# EasyEDA schematic External MIDI Interface.json
TITLE: XMIDIMixer; REV: 1.0; Date: 2022-04-16; Sheet: 1/1; Drawn By: OctSL; Company: Your Company
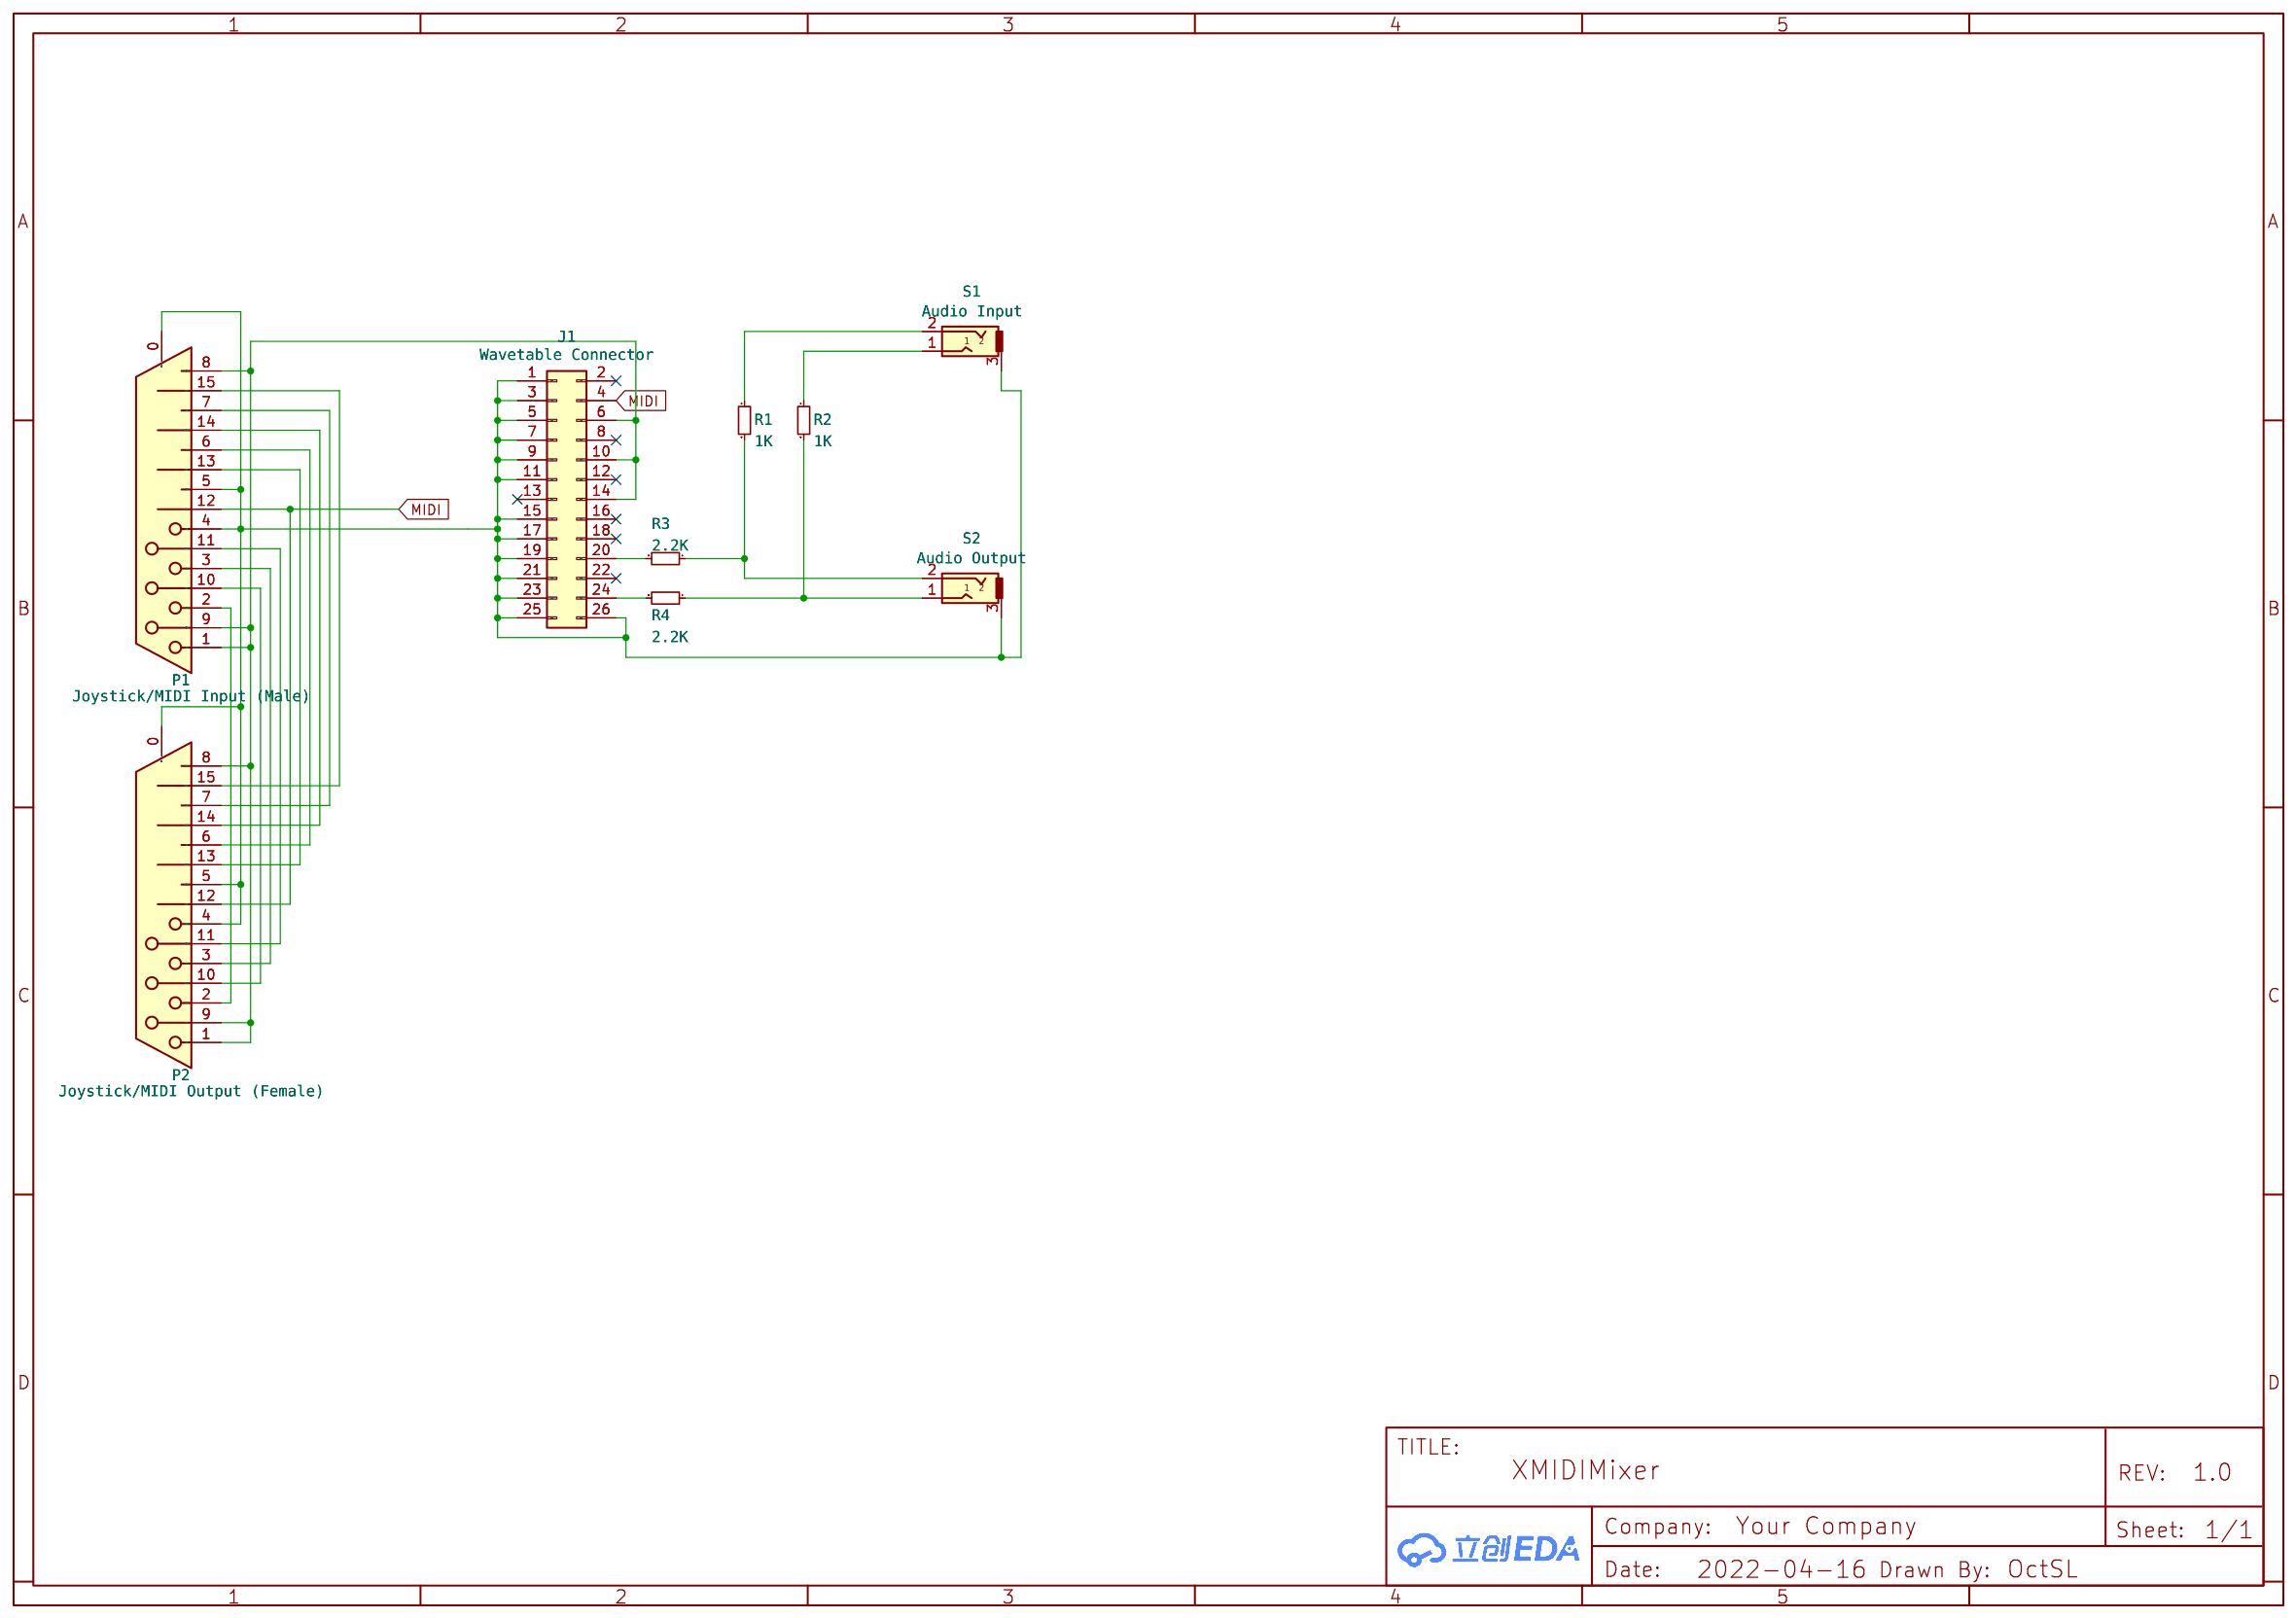
[diagram p0: schematic sheet]

## Parts
J1  Wavetable Connector  [PINSOCKET_2X13_P2.54MM_VERTICAL]
P1  Joystick/MIDI Input (Male)  [SB_DB15_152-3415]
P2  Joystick/MIDI Output (Female)  [SB_DB15_152-3415]
R1  1K  [SB_R_AXIAL_400]
R2  1K  [SB_R_AXIAL_400]
R3  2.2K  [SB_R_AXIAL_400]
R4  2.2K  [SB_R_AXIAL_400]
S1  Audio Input  [SB_SJ1-3553]
S2  Audio Output  [SB_SJ1-3553]

## Library data of the parts
P1 P2 = -: Mouser: 152-3415
R1 R2 = -: Mouser: 603-CFR-25JB-52-47K
R3 R4 = -: Mouser: 603-CFR-25JB-52-15K
S1 S2 = -: Mouser: 490-SJ1-3553NG

## Nets
MIDI: J1.4(Pin) P1.12(P12) P2.12(P12)
Net-(J1-1): J1.1(Pin) J1.3(Pin) J1.5(Pin) J1.7(Pin) J1.9(Pin) J1.11(Pin) J1.15(Pin) J1.17(Pin) J1.19(Pin) J1.21(Pin) J1.23(Pin) J1.25(Pin) J1.26(Pin) P1.0(PAD) P1.4 P1.5 P2.0(PAD) P2.4 P2.5 S1.3 S2.3
Net-(J1-6): J1.6(Pin) J1.10(Pin) J1.14(Pin) P1.1 P1.8 P1.9(P9) P2.1 P2.8 P2.9(P9)
Net-(J1-20): J1.20(Pin) R3.2
Net-(J1-24): J1.24(Pin) R4.2
Net-(P1-2): P1.2 P2.2
Net-(P1-3): P1.3 P2.3
Net-(P1-6): P1.6 P2.6
Net-(P1-7): P1.7 P2.7
Net-(P1-10): P1.10(P10) P2.10(P10)
Net-(P1-11): P1.11(P111) P2.11(P111)
Net-(P1-13): P1.13(P13) P2.13(P13)
Net-(P1-14): P1.14(P14) P2.14(P14)
Net-(P1-15): P1.15(P15) P2.15(P15)
Net-(R1-1): R1.1 S1.2
Net-(R1-2): R1.2 R3.1 S2.2
Net-(R2-1): R2.1 S1.1
Net-(R2-2): R2.2 R4.1 S2.1

Not connected (* = marked no-connect by the designer): J1 2(Pin)* 8(Pin)* 12(Pin)* 13(Pin)* 16(Pin)* 18(Pin)* 22(Pin)*
